# Altium schematic sheet ethernet.SchDoc: Ethernet
size A3; ApprovedBy: dvarx; CompanyName: MSRL; DrawnBy: dvarx; Engineer: dvarx; Organization: MSRL; SheetNumber: 6; SheetTotal: 6
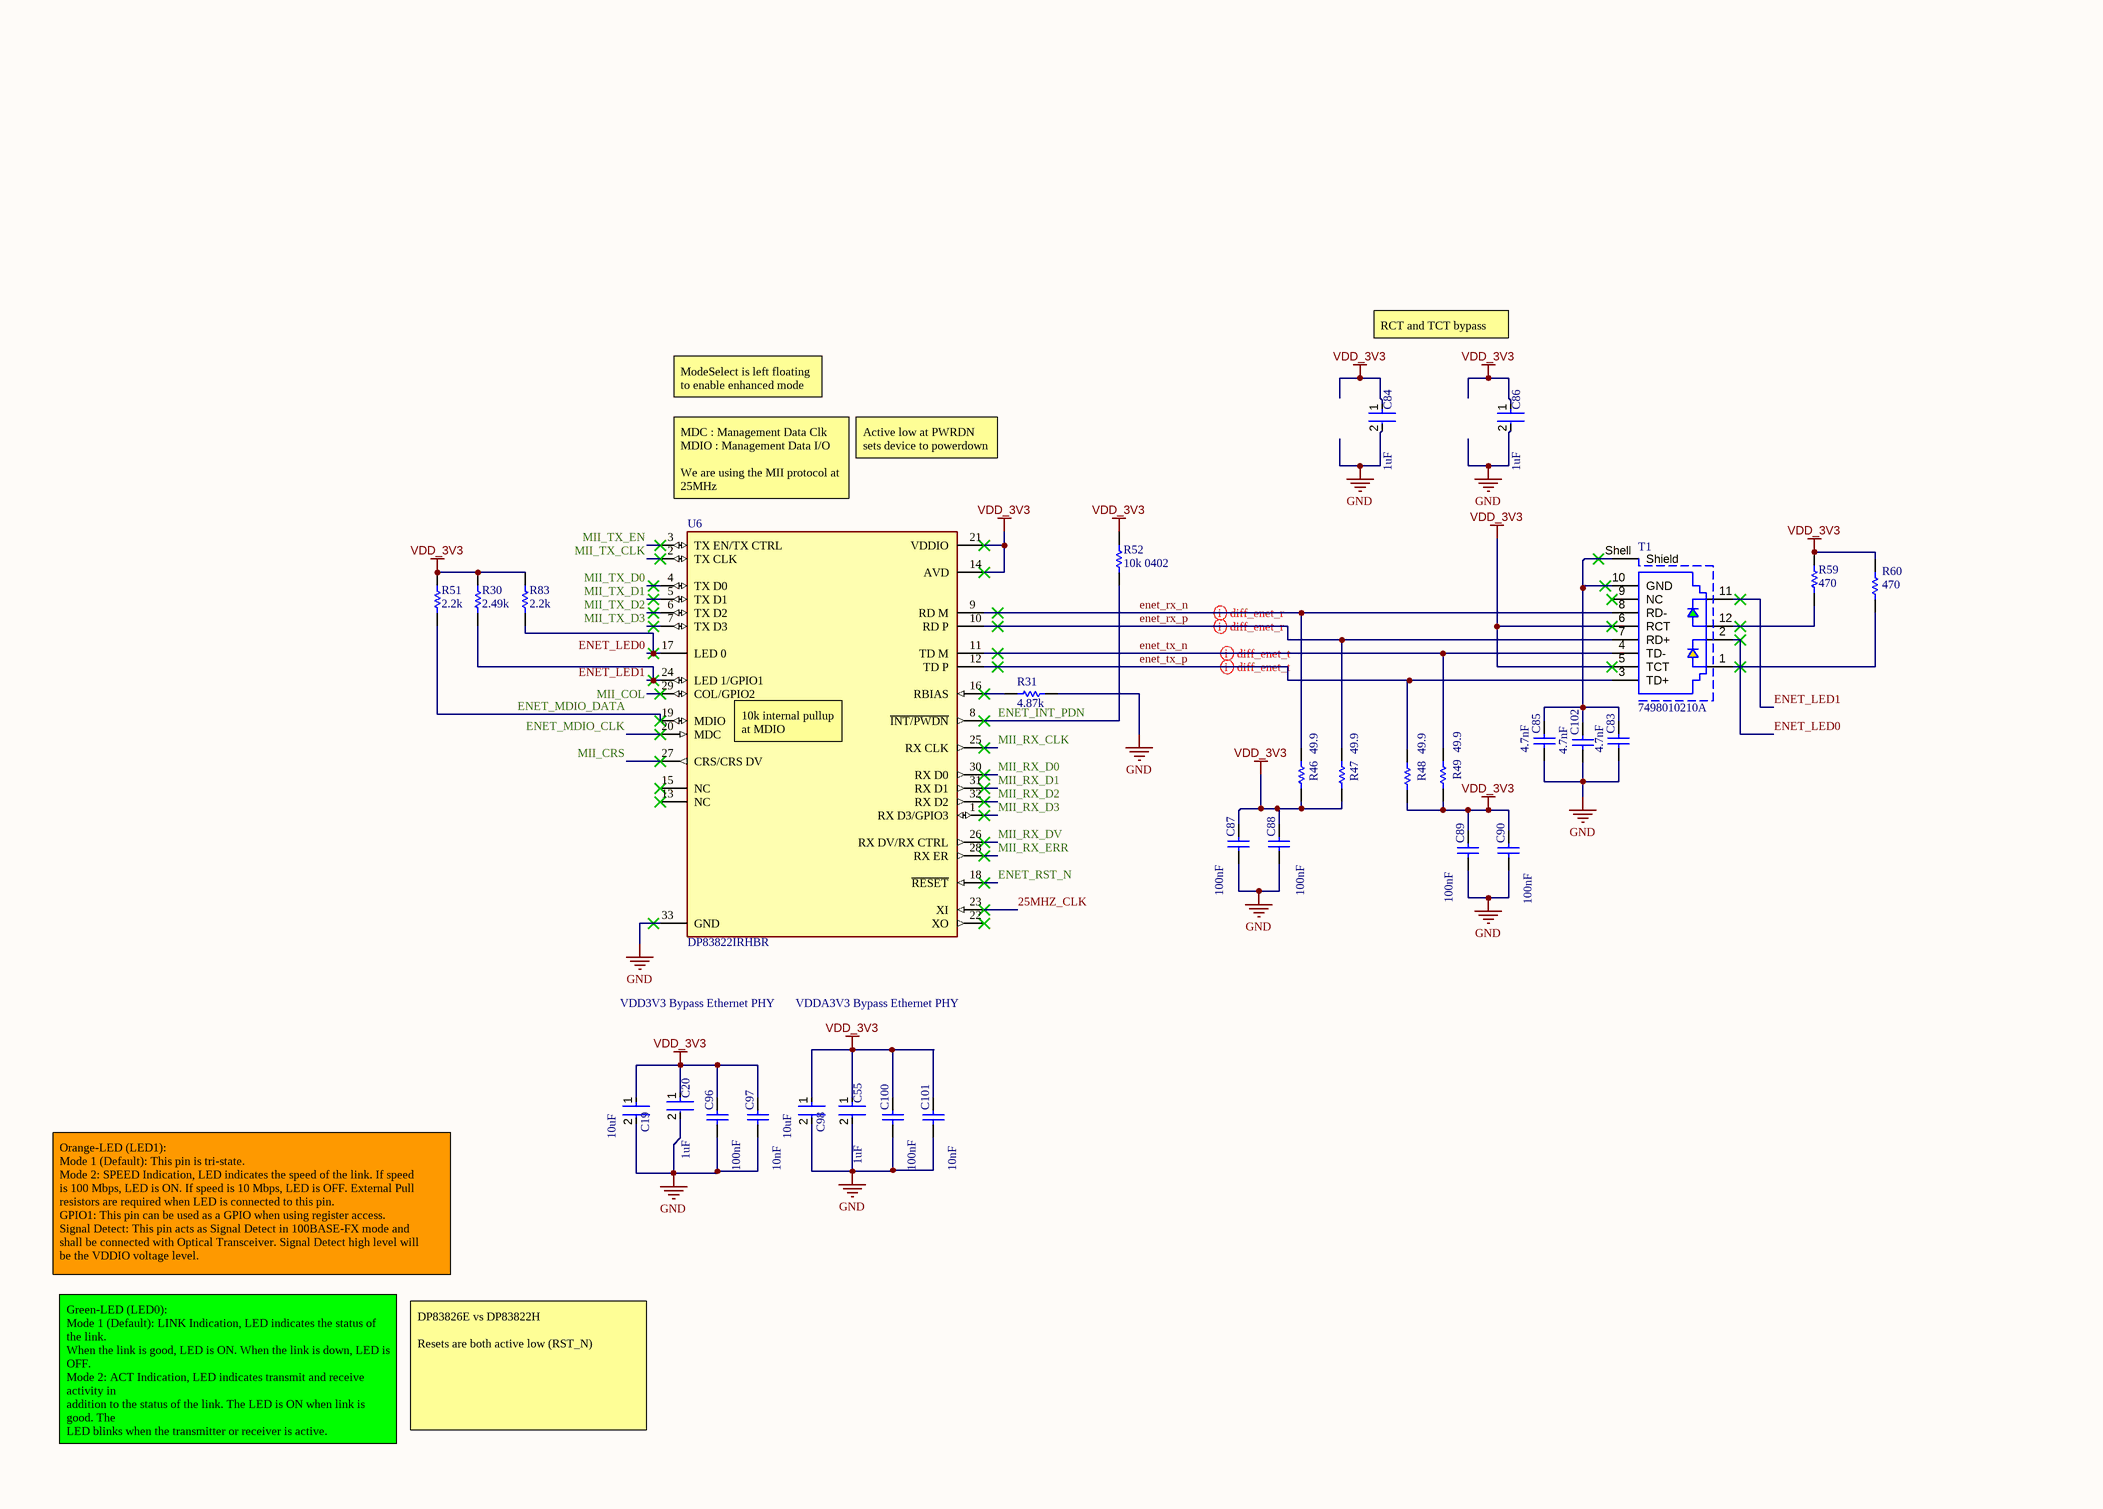
[diagram p0: ethernet.SchDoc]

## Parts
C19  10uF  [FP-CL05A106MP5NUNC-MFG]
C20  1uF  [FP-C0402C105K8PACTU-MFG]
C55  1uF  [FP-C0402C105K8PACTU-MFG]
C83  4.7nF  [CAP 0603_1608]
C84  1uF  [FP-C0402C105K8PACTU-MFG]
C85  4.7nF  [CAP 0603_1608]
C86  1uF  [FP-C0402C105K8PACTU-MFG]
C87  100nF  [CAP 0402_1005]
C88  100nF  [CAP 0402_1005]
C89  100nF  [CAP 0402_1005]
C90  100nF  [CAP 0402_1005]
C96  100nF  [CAP 0402_1005]
C97  10nF  [CAP 0402_1005]
C98  10uF  [FP-CL05A106MP5NUNC-MFG]
C100  100nF  [CAP 0402_1005]
C101  10nF  [CAP 0402_1005]
C102  4.7nF  [CAP 0603_1608]
R30  2.49k  [RES 0402_1005]
R31  4.87k  [RES 0402_1005]
R46  49.9  [RES 0402_1005]
R47  49.9  [RES 0402_1005]
R48  49.9  [RES 0402_1005]
R49  49.9  [RES 0402_1005]
R51  2.2k  [RES 0402_1005]
R52  10k 0402  [RES 0402_1005]
R59  470  [RES 0402_1005]
R60  470  [RES 0402_1005]
R83  2.2k  [RES 0402_1005]
T1  7498010210A  [7498010210A]
U6  DP83822IRHBR  [FP-RHB0032B-IPC_C]

## Nets
GND: C19.2 C20.2 C55.2 C83.1 C84.2 C85.1 C86.2 C87.1 C88.1 C89.1 C90.1 C96.1 C97.1 C98.2 C100.1 C101.1 C102.1 R31.1 U6.33(GND)
VDD_3V3: C19.1 C20.1 C55.1 C84.1 C86.1 C87.2 C88.2 C89.2 C90.2 C96.2 C97.2 C98.1 C100.2 C101.2 R30.1 R46.1 R47.1 R48.1 R49.1 R51.1 R52.2 R59.1 R60.1 R83.1 T1.5(TCT) T1.6(RCT) U6.14(AVD) U6.21(VDDIO)
25MHZ_CLK: U6.23(XI)
ENET_INT_PDN: R52.1 U6.8(~{INT/PWDN})
ENET_LED0: R83.2 T1.2 U6.17(LED_0)
ENET_LED1: R30.2 T1.11 U6.24(LED_1/GPIO1)
ENET_MDIO_CLK: U6.20(MDC)
ENET_MDIO_DATA: R51.2 U6.19(MDIO)
ENET_RST_N: U6.18(~{RESET})
enet_rx_n: R46.2 T1.8(RD-) U6.9(RD_M)
enet_rx_p: R47.2 T1.7(RD+) U6.10(RD_P)
enet_tx_n: R49.2 T1.4(TD-) U6.11(TD_M)
enet_tx_p: R48.2 T1.3(TD+) U6.12(TD_P)
MII_COL: U6.29(COL/GPIO2)
MII_CRS: U6.27(CRS/CRS_DV)
MII_RX_CLK: U6.25(RX_CLK)
MII_RX_D0: U6.30(RX_D0)
MII_RX_D1: U6.31(RX_D1)
MII_RX_D2: U6.32(RX_D2)
MII_RX_D3: U6.1(RX_D3/GPIO3)
MII_RX_DV: U6.26(RX_DV/RX_CTRL)
MII_RX_ERR: U6.28(RX_ER)
MII_TX_CLK: U6.2(TX_CLK)
MII_TX_D0: U6.4(TX_D0)
MII_TX_D1: U6.5(TX_D1)
MII_TX_D2: U6.6(TX_D2)
MII_TX_D3: U6.7(TX_D3)
MII_TX_EN: U6.3(TX_EN/TX_CTRL)
NetC83_2: C83.2 C85.2 C102.2 T1.10(GND) T1.Shell(Shield)
NetR31_2: R31.2 U6.16(RBIAS)
NetR59_2: R59.2 T1.12
NetR60_2: R60.2 T1.1

Not connected (* = marked no-connect by the designer): T1 9(NC)*; U6 13(NC)* 15(NC)* 22(XO)*

## Layout directives
differential pair; differential pair class diff_enet_tr: enet_tx_n, enet_tx_p
differential pair; differential pair class diff_enet_r: enet_rx_n, enet_rx_p

## Notes on the sheet
- RCT and TCT bypass
- ModeSelect is left floating to enable enhanced mode
- Active low at PWRDN sets device to powerdown
- (near U6) MDC : Management Data Clk
  MDIO : Management Data I/O
  We are using the MII protocol at 25MHz
- (near U6) 10k internal pullup at MDIO
- VDD3V3 Bypass Ethernet PHY
- VDDA3V3 Bypass Ethernet PHY
- Orange-LED (LED1):
  Mode 1 (Default): This pin is tri-state.
  Mode 2: SPEED Indication, LED indicates the speed of the link. If speed
  is 100 Mbps, LED is ON. If speed is 10 Mbps, LED is OFF. External Pull
  resistors are required when LED is connected to this pin.
  GPIO1: This pin can be used as a GPIO when using register access.
  Signal Detect: This pin acts as Signal Detect in 100BASE-FX mode and
  shall be connected with Optical Transceiver. Signal Detect high level will
  be the VDDIO voltage level.
- Green-LED (LED0):
  Mode 1 (Default): LINK Indication, LED indicates the status of the link.
  When the link is good, LED is ON. When the link is down, LED is OFF.
  Mode 2: ACT Indication, LED indicates transmit and receive activity in
  addition to the status of the link. The LED is ON when link is good. The
  LED blinks when the transmitter or receiver is active.
- DP83826E vs DP83822H
  Resets are both active low (RST_N)
- THIS DOCUMENT AND THE DATA DISCLOSED HEREIN OR
- HEREWITH IS THE PROPERTY OF ALTIUM LIMITED AND MAY
- DWG NO:
- REVISION
- REV:
- DESCRIPTION
- DATE
- APPROVED
- BE FREELY DISTRIBUTED IN WHOLE. NO RIGHTS ARE
- RESERVED OR EXPRESS OR IMPLIED WARANTEE GIVEN.
- ENG:
- APPROVALS
- PROJECT
- DSN:
- CHK:
- REFERENCE DOCUMENTS
- PROJECT REVISION:
- TITLE
- DOCUMENT REVISION:
- DESIGN ITEM:
- BOM:
- FAB DWG:
- PCB DWG:
- ASSY DWG:
- SCALE:
- A3
- SIZE
- CAGE CODE
- FILE NAME
- DWG NO.
- SHEET
- OF
- REV

## Library data of the parts
C19 C98 = CMP-13271-000002-1: MLCC 10uF 0402 10V; Manufacturer Part Number: CL05A106MP5NUNC; Manufacturer: Samsung; Temperature Coefficient: 15%; Tolerance: 20%; Temperature Characteristic: X5R; Material: Ceramic; Octopart: https://octopart.com/cl05a106mp5nunc-samsung-22457395; Voltage Rating: 10V; RoHS: TRUE; Value: 10uF; Height: 0.7mm; Digikey Description: CAP CER 10UF 10V X5R 0402; Automotive: No; Package: CL05A106MP5NUNC; Device Class L1: Passive Components; Capacitance: 10uF; Temperature Range High: +85°C; ComponentLink2Description: Datasheet; Device Class L2: Capacitors; Temperature: -55°C to +85°C; ComponentLink2URL: http://www.samsungsem.com/kr/support/product-search/mlcc/__icsFiles/afieldfile/2019/05/10/19-CL05A106MP5NUNC.pdf; Device Class L3: Ceramic Capacitors; Category: Cap; Temperature Range Low: -55°C; Ipc Land Pattern Name: CAPC10050X50; Lead Free: Yes
C20 C55 C84 C86 = CMP-2008-02081-2: MLCC 1uF 0402 10V; Dielectric Material: Ceramic; Dissipation Factor: 5%; Dielectric: X5R; Tolerance: 10%; Number of Pins: 2; Contact Plating: Tin; Min Operating Temperature: -55°C; Termination: SMD/SMT; Lead Free: Lead Free; Construction: Flat; Voltage Rating (DC): 10V; Mount: Surface Mount; Series: C; Thickness: 0.022inch; Width: 0.5mm; Radiation Hardening: No; Capacitance: 1uF; Height: 0.5mm; Voltage: 10V; Length: 1mm; Depth: 0.5mm; Max Operating Temperature: 85°C; Package Quantity: 1; Packaging: Tape and Reel; RoHS Compliant: Yes; Case Code (Imperial): 0402; Case Code (Metric): 1005; REACH SVHC: No SVHC; Voltage Rating: 10V; Case/Package: 0402
C83 C85 C102 = Cap: MLCC 4.7nF 0603 10V; Published: 8-Jun-2000; LatestRevisionDate: 17-Jul-2002; LatestRevisionNote: Re-released for DXP Platform.; PackageReference: RAD-0.3; Publisher: Altium Limited; PackageDescription: Radial Cap, Thru-Hole; 2 Leads; 0.3 in Pin Spacing; Value: 4.7nF
C87-C90 C96 C100 = Cap: MLCC 100nF 0402 10V; Published: 8-Jun-2000; LatestRevisionDate: 17-Jul-2002; LatestRevisionNote: Re-released for DXP Platform.; PackageReference: RAD-0.3; Publisher: Altium Limited; PackageDescription: Radial Cap, Thru-Hole; 2 Leads; 0.3 in Pin Spacing; Value: 100nF
C97 C101 = Cap: MLCC 10nF 0402 5V; Value: 100nF; Published: 8-Jun-2000; LatestRevisionDate: 17-Jul-2002; LatestRevisionNote: Re-released for DXP Platform.; PackageReference: RAD-0.3; Publisher: Altium Limited; PackageDescription: Radial Cap, Thru-Hole; 2 Leads; 0.3 in Pin Spacing
R30 = Res1: Resistor 2.49kOhm 0402 1%; Published: 8-Jun-2000; LatestRevisionDate: 17-Jul-2002; LatestRevisionNote: Re-released for DXP Platform.; PackageReference: AXIAL-0.3; Publisher: Altium Limited; PackageDescription: Axial Device, Thru-Hole; 2 Leads; 0.3 in Pin Spacing; Value: 2.49k; Supplier 1: Mouser; Supplier Part Number 1: 71-CRCW0402-2.49K-E3
R31 = Res1: Resistor 4.87kOhm 0402 1%; Published: 8-Jun-2000; LatestRevisionDate: 17-Jul-2002; LatestRevisionNote: Re-released for DXP Platform.; PackageReference: AXIAL-0.3; Publisher: Altium Limited; PackageDescription: Axial Device, Thru-Hole; 2 Leads; 0.3 in Pin Spacing; Value: 4.87k; Supplier 1: Mouser; Supplier Part Number 1: 71-CRCW0402-4.87K-E3
R46-R49 = Res1: Resistor 49.9Ohm 0402; Published: 8-Jun-2000; LatestRevisionDate: 17-Jul-2002; LatestRevisionNote: Re-released for DXP Platform.; PackageReference: AXIAL-0.3; Publisher: Altium Limited; PackageDescription: Axial Device, Thru-Hole; 2 Leads; 0.3 in Pin Spacing; Value: 49.9
R51 R83 = Res1: Resistor 2.2kOhm 0402; Published: 8-Jun-2000; LatestRevisionDate: 17-Jul-2002; LatestRevisionNote: Re-released for DXP Platform.; PackageReference: AXIAL-0.3; Publisher: Altium Limited; PackageDescription: Axial Device, Thru-Hole; 2 Leads; 0.3 in Pin Spacing; Value: 2.2k
R52 = Res1: Resistor 10kOhm 0402; Published: 8-Jun-2000; LatestRevisionDate: 17-Jul-2002; LatestRevisionNote: Re-released for DXP Platform.; PackageReference: AXIAL-0.3; Publisher: Altium Limited; PackageDescription: Axial Device, Thru-Hole; 2 Leads; 0.3 in Pin Spacing; Value: 10k
R59 R60 = Res1: Resistor 470Ohm 0603; Value: 2.2k; Published: 8-Jun-2000; LatestRevisionDate: 17-Jul-2002; LatestRevisionNote: Re-released for DXP Platform.; PackageReference: AXIAL-0.3; Publisher: Altium Limited; PackageDescription: Axial Device, Thru-Hole; 2 Leads; 0.3 in Pin Spacing
T1 = CMP-03913-78125990-2: 7498010210A Telecom and Datacom Connector, 8 Contact(s), Female, Right Angle, Surface Mount Terminal; Color: Silver; Connector Type: Socket; Insertion Loss (dB): -1dB; Inductance: 350µH; Length: 25.4mm; Contact Material: Gold; Height: 13.61mm; Width: 16.1mm; Min Operating Temperature: -40°C; Max Operating Temperature: 85°C; RoHS: Non-Compliant; NexarPartId: 78125990; Case/Package: Metal
U6 = CMP-04874-000006-1: IC INTERFACE SPECIALIZED 32VQFN; Cable Length: 150m; Data Rate: 100Kbps; Max Operating Temperature: 85°C; Min Operating Temperature: -40°C; Packaging: Tape and Reel; Case/Package: VQFN; Lead Free: Lead Free; Mount: Surface Mount; RoHS Compliant: Yes